# Altium schematic sheet 03_MCU.SchDoc: ECE315 MCU
size A; Date: 4/25/2017; ApprovedBy: JSK; CheckedBy: JSK; Author: JSK; CompanyName: University of Wisconsin; DrawnBy: JSK; Engineer: JSK; Organization: ECE 315; Address1: College of Engineering; Address2: 1415 Engineering Drive; Address3: Madison, WI 53706; Address4: ECE 315 Spring 2018; Revision: A; SheetNumber: 3; SheetTotal: 6; AssemblyNumber: ECE315-S18; ApprovedDate: 01/08/2018
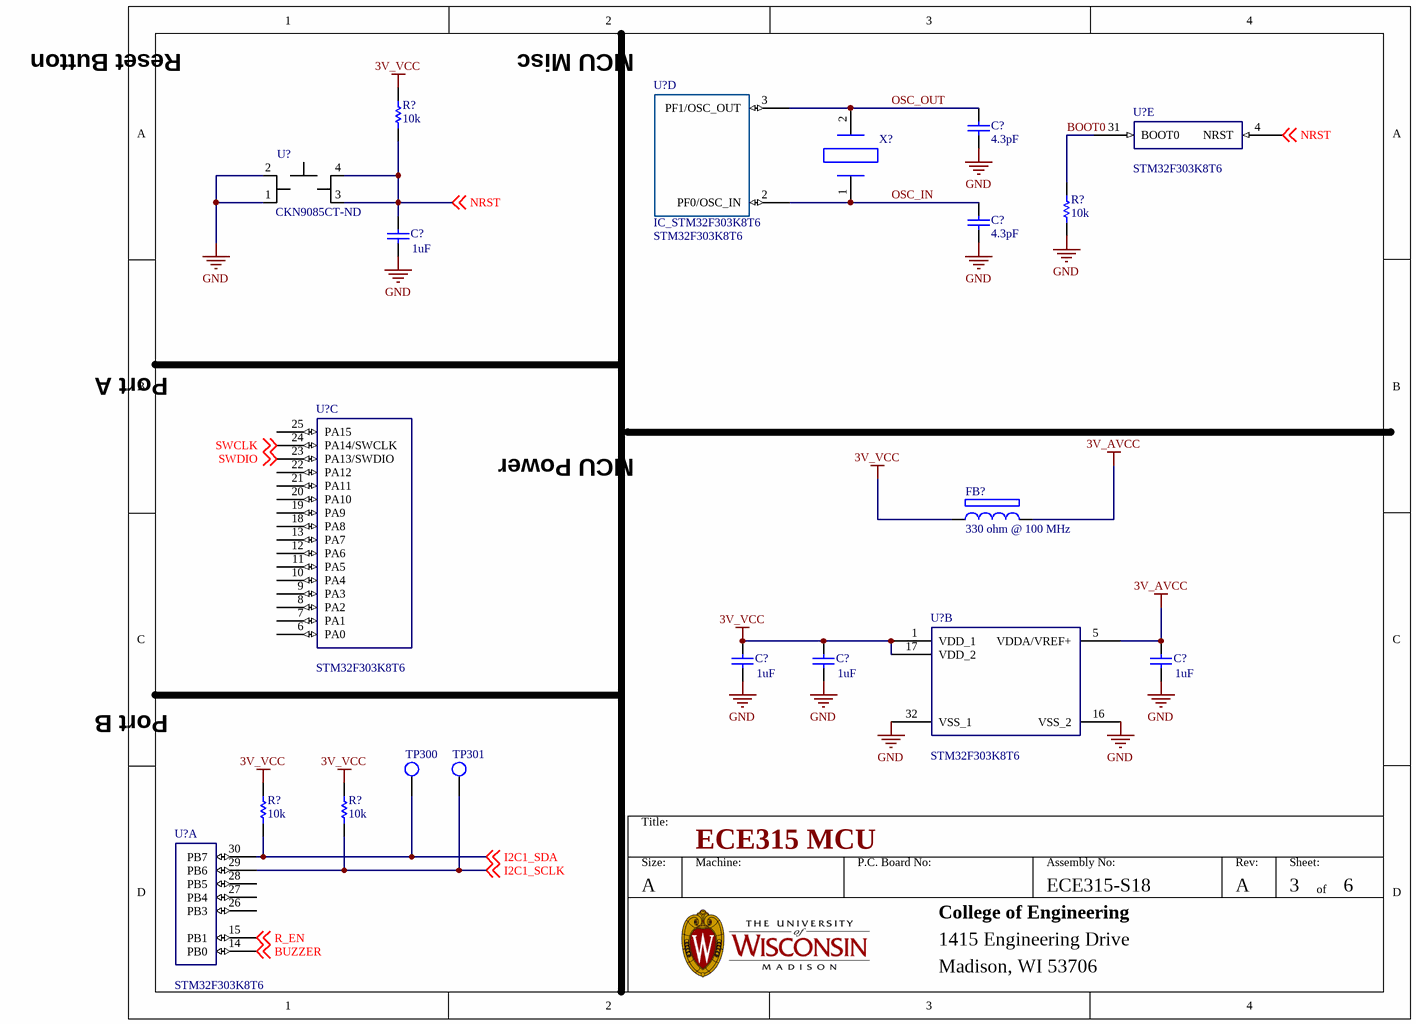
[diagram p0: 03_MCU.SchDoc]

## Parts
(Parts that share a designator on the sheet are numbered #1, #2 ... from top to bottom, then left to right.)
C?#1  Manufacturer Part Number: 4.3pF  [CAP_0805]  (hidden comment: CAP_0805_P_004.30)
C?#2  Capacity: 1uF  [CAP_0805]  (hidden comment: CAP_0805_U_001.00)
C?#3  Manufacturer Part Number: 4.3pF  [CAP_0805]  (hidden comment: CAP_0805_P_004.30)
C?#4  Capacity: 1uF  [CAP_0805]  (hidden comment: CAP_0805_U_001.00)
C?#5  Capacity: 1uF  [CAP_0805]  (hidden comment: CAP_0805_U_001.00)
C?#6  Capacity: 1uF  [CAP_0805]  (hidden comment: CAP_0805_U_001.00)
FB?  330 ohm @ 100 MHz  [FB_0805]
R?#1  10K  [RES_0805]
R?#2  10K  [RES_0805]
R?#3  10K  [RES_0805]
R?#4  10K  [RES_0805]
TP300  TP_1206  [TP-SMC-1206]  (value not drawn)
TP301  TP_1206  [TP-SMC-1206]  (value not drawn)
U?#1  IC_STM32F303K8T6  Manufacturer Part Number: STM32F303K8T6  [IC_STM32M]  (part D of 5)
U?#2  Manufacturer Part Number: STM32F303K8T6  [IC_STM32M]  (hidden comment: IC_STM32F303K8T6)  (part E of 5)
U?#3  Supplier Part Number 1: CKN9085CT-ND  [SW_6mm_6mm_SMT]  (hidden comment: SW_6mm_6mm_SMT)
U?#4  Manufacturer Part Number: STM32F303K8T6  [IC_STM32M]  (hidden comment: IC_STM32F303K8T6)  (part B of 5)
U?#5  Manufacturer Part Number: STM32F303K8T6  [IC_STM32M]  (hidden comment: IC_STM32F303K8T6)  (part C of 5)
U?#6  Manufacturer Part Number: STM32F303K8T6  [IC_STM32M]  (hidden comment: IC_STM32F303K8T6)  (part A of 5)
X?  32.7680KHZ 12.5PF  [NX3215SA-32.768K-STD-MUA-8]  (value not drawn)

## Nets
3V_AVCC: C?#6.1 FB?.2 U?#4.5(VDDA/VREF+)
3V_VCC: C?#4.1 C?#5.1 FB?.1 R?#1.2 R?#3.2 R?#4.2 U?#4.1(VDD_1) U?#4.17(VDD_2)
GND: C?#1.1 C?#2.2 C?#3.1 C?#4.2 C?#5.2 C?#6.2 R?#2.1 U?#3.1 U?#3.2 U?#4.16(VSS_2) U?#4.32(VSS_1)
BOOT0: R?#2.2 U?#2.31(BOOT0)
BUZZER: U?#6.14(PB0) ; off-sheet BUZZER
I2C1_SCLK: R?#4.1 TP301.1 U?#6.29(PB6) ; off-sheet I2C1_SCLK
I2C1_SDA: R?#3.1 TP300.1 U?#6.30(PB7) ; off-sheet I2C1_SDA
NRST: C?#2.1 R?#1.1 U?#2.4(NRST) U?#3.3 U?#3.4(VCCIO) ; off-sheet NRST
OSC_IN: C?#3.2 U?#1.2(PF0/OSC_IN) X?.1
OSC_OUT: C?#1.2 U?#1.3(PF1/OSC_OUT) X?.2
R_EN: U?#6.15(PB1) ; off-sheet R_EN
SWCLK: U?#5.24(PA14/SWCLK) ; off-sheet SWCLK
SWDIO: U?#5.23(PA13/SWDIO) ; off-sheet SWDIO

Not connected (* = marked no-connect by the designer): U?#5 6(PA0) 7(PA1) 8(PA2) 9(PA3) 10(PA4) 11(PA5) 12(PA6) 13(PA7) 18(PA8) 19(PA9) 20(PA10) 21(PA11) 22(PA12) 25(PA15); U?#6 26(PB3) 27(PB4) 28(PB5)

## Notes on the sheet
- Reset Button
- (near U?#1) MCU Misc
- Port A
- MCU Power
- Port B
- Title:
- Size:
- A
- Machine:
- P.C. Board No:
- Assembly No:
- Rev:
- Sheet:
- of
- College of Engineering
- 1415 Engineering Drive
- Madison, WI 53706

## Library data of the parts
C?#1 C?#3 = CAP_0805_P_004.30: CAP CER 4.3PF 100V NP0 0805; Manufacturer: AVX Corporation; Tolerance: ±0.25pF; Temperature Coefficient: C0G, NP0; Notification: Current market demand for these product types have resulted in fluctuating and extending lead times. Lead times may differ.; Supplier 1: Digi-Key; RoHS: RoHS Compliant; Category: Capacitors; Stock 1: 21910; Pricing 1: 1=0.24, 10=0.167, 100=0.0946, 500=0.0668, 1000=0.05844 (USD); Packaging: Cut Tape (CT); Part Status: Active; Voltage - Rated: 100V; Operating Temperature: -55°C ~ 125°C; Features: -; Ratings: -; Applications: General Purpose; Failure Rate: -; Mounting Type: Surface Mount, MLCC; Package / Case: 0805 (2012 Metric); Size / Dimension: 0.079" L x 0.049" W (2.01mm x 1.25mm); Height - Seated (Max): -; Thickness (Max): 0.037" (0.94mm); Lead Spacing: -; Lead Style: -; ComponentLink1URL: http://datasheets.avx.com/C0GNP0-Dielectric.pdf; ComponentLink1Description: http://datasheets.avx.com/C0GNP0-Dielectric.pdf; Supplier Part Number 1: 478-10404-1-ND
C?#2 C?#4-C?#6 = CAP_0805_U_001.00: CAP CER 1UF 16V 10% X7R 0805; Manufacturer: Yageo; Manufacturer Part Number: CC0805KKX7R7BB105; Notification: Current market demand for these product types have resulted in fluctuating and extending lead times. Lead times may differ.; Supplier 1: Digi-Key; RoHS: RoHS Compliant; Category: Capacitors; Stock 1: 1057802; Pricing 1: 1=0.11, 10=0.079, 100=0.0352, 500=0.02516, 1000=0.01977 (USD); Packaging: Cut Tape (CT); Part Status: Active; Tolerance: ±10%; Voltage - Rated: 16V; Temperature Coefficient: X7R; Operating Temperature: -55°C ~ 125°C; Features: -; Ratings: -; Applications: General Purpose; Failure Rate: -; Mounting Type: Surface Mount, MLCC; Package / Case: 0805 (2012 Metric); Size / Dimension: 0.079" L x 0.049" W (2.00mm x 1.25mm); Height - Seated (Max): -; Thickness (Max): 0.049" (1.25mm); Lead Spacing: -; Lead Style: -; ComponentLink1URL: http://www.yageo.com/documents/recent/UPY-GPHC_X7R_6.3V-to-50V_18.pdf; ComponentLink1Description: http://www.yageo.com/documents/recent/UPY-GPHC_X7R_6.3V-to-50V_18.pdf; Supplier Part Number 1: 311-1365-1-ND
FB? = FB 330 ohm @ 100 MHz: Manufacturer: TDK Corporation; Manufacturer Part Number: MPZ2012S331AT000; Current Rating: 2.5A; DC Resistance (DCR): 50 mOhm Max; Filter Type: Differential Mode - Single; Supplier 1: Digi-Key; RoHS: RoHS Compliant; Category: Filters; Stock 1: 154063; Pricing 1: 1=0.12, 10=0.101, 100=0.0574, 250=0.04528, 500=0.03824, 1000=0.03221 (USD); Packaging: Cut Tape (CT); Impedance @ Frequency: 330 Ohm @ 100MHz; Package / Case: 0805 (2012 Metric); Mounting Type: Surface Mount; Height (Max): 0.041" (1.05mm); Size / Dimension: 0.079" L x 0.049" W (2.00mm x 1.25mm); ComponentLink1URL: http://product.tdk.com/en/catalog/datasheets/beads_commercial_power_mpz_en.pdf; ComponentLink1Description: http://product.tdk.com/en/catalog/datasheets/beads_commercial_power_mpz_en.pdf; Supplier Part Number 1: 445-1569-1-ND
R?#1-R?#4 = RES_0805_K_010.00: RES SMD 10K OHM 1% 1/8W 0805; Manufacturer: Yageo; Manufacturer Part Number: RT0805FRE0710KL; Power (Watts): 0.125W, 1/8W; Temperature Coefficient: ±50ppm/°C; Supplier 1: Digi-Key; RoHS: RoHS Compliant; Category: Resistors; Stock 1: 74175; Pricing 1: 1=0.1, 10=0.075, 100=0.0287, 1000=0.01261, 2500=0.01089 (USD); Packaging: Cut Tape (CT); Part Status: Active; Tolerance: ±1%; Composition: Thin Film; Features: Moisture Resistant; Operating Temperature: -55°C ~ 155°C; Package / Case: 0805 (2012 Metric); Supplier Device Package: 0805; Size / Dimension: 0.079" L x 0.049" W (2.00mm x 1.25mm); Height - Seated (Max): 0.024" (0.60mm); Failure Rate: -; ComponentLink1URL: http://www.yageo.com/documents/recent/PYu-RT_1-to-0.01_RoHS_L_9.pdf; ComponentLink1Description: http://www.yageo.com/documents/recent/PYu-RT_1-to-0.01_RoHS_L_9.pdf; Supplier Part Number 1: YAG1239CT-ND; Resistance: 10k
TP300 TP301 = TP_1206: Test Point SMD 1206; Manufacturer: TE Connectivity (Tyco Electronics); Manufacturer Part Number: 1625854-1; Resistance Value: 0 Ohm; Temperature Coefficient: N/R; Supplier 1: Digi-Key; Stock 1: 31937; Pricing 1: 1=0.28, 10=0.261, 25=0.224, 50=0.1902, 100=0.1828, 250=0.1641, 500=0.1567, 1000=0.1306 (USD); Case Size: 1206; Dimension: 3.2 x 1.6 x 1.25mm; Family: RC; Mounting: Surface Mount; Operating Temperature: -55 to 125 C; Part No: 1625854-1; RoHS: Yes; Packaging: Tape and Reel; Termination Style: N/R; Terminal Pitch: N/R; Power Rating: N/R; Tolerance: N/R; ComponentLink1URL: https://datasheet.ciiva.com/6439/eng-ds-1773266-a-6439169.pdf; ComponentLink1Description: https://datasheet.ciiva.com/6439/eng-ds-1773266-a-6439169.pdf; ComponentLink2URL: https://datasheet.ciiva.com/30136/1773266-a-30136341.pdf; ComponentLink2Description: https://datasheet.ciiva.com/30136/1773266-a-30136341.pdf; ComponentLink3URL: https://datasheet.ciiva.com/6439/eng-ds-1773266-a-6439080.pdf; ComponentLink3Description: https://datasheet.ciiva.com/6439/eng-ds-1773266-a-6439080.pdf; ComponentLink4URL: https://datasheet.ciiva.com/6439/eng-ds-1773266-a-6439081.pdf; ComponentLink4Description: https://datasheet.ciiva.com/6439/eng-ds-1773266-a-6439081.pdf; ComponentLink5URL: https://datasheet.ciiva.com/6439/eng-ds-1773266-a-6439083.pdf; ComponentLink5Description: https://datasheet.ciiva.com/6439/eng-ds-1773266-a-6439083.pdf; Supplier Part Number 1: A106143CT-ND
U?#1 U?#2 U?#4-U?#6 = IC_STM32F303K8T6: Manufacturer: STMicroelectronics; Core Processor: ARM® Cortex®-M4; Core Size: 32-Bit; Speed: 72MHz; Connectivity: CAN, I²C, IrDA, LIN, SPI, UART/USART; Peripherals: DMA, I²S, POR, PWM, WDT; Program Memory Size: 64KB (64K x 8); Program Memory Type: FLASH; RAM Size: 12K x 8; Voltage - Supply (Vcc/Vdd): 2 V ~ 3.6 V; Data Converters: A/D 9x12b, D/A 3x12b; Oscillator Type: Internal; Supplier 1: Digi-Key; RoHS: RoHS Compliant; Category: Integrated Circuits (ICs); Stock 1: 1323; Pricing 1: 1=4.28, 10=3.846, 100=3.1512, 500=2.68256, 1000=2.2624 (USD); Packaging: Tray; Part Status: Active; EEPROM Size: -; Operating Temperature: -40°C ~ 85°C (TA); Package / Case: 32-LQFP; Supplier Device Package: 32-LQFP (7x7); ComponentLink1URL: http://www.st.com/content/ccc/resource/technical/document/datasheet/group3/38/c6/ca/d1/f7/d5/4e/30/DM00092070/files/DM00092070.pdf/jcr:content/translations/en.DM00092070.pdf; ComponentLink1Description: http://www.st.com/content/ccc/resource/technical/document/datasheet/group3/38/c6/ca/d1/f7/d5/4e/30/DM00092070/files/DM00092070.pdf/jcr:content/translations/en.DM00092070.pdf; Supplier Part Number 1: 497-15828-ND
U?#3 = SW_6mm_6mm_SMT: SWITCH TACTILE SPST-NO 0.05A 12V; Manufacturer: C&K; Manufacturer Part Number: PTS645SH50SMTR92 LFS; Switch Function: Off-Mom; Contact Rating @ Voltage: 0.05A @ 12VDC; Actuator Type: Standard; Actuator Height off PCB, Vertical: 5.00mm; Actuator Orientation: Top Actuated; Outline: 6.00mm x 6.00mm; Illumination: Non-Illuminated; Operating Force: 200gf; Actuator Material: Polyamide (PA66), Nylon 6/6; Mechanical Life: 100,000 Cycles; Supplier 1: Digi-Key; RoHS: RoHS Compliant; Category: Switches; Stock 1: 73248; Pricing 1: 1=0.22, 10=0.215, 25=0.2076, 50=0.2002, 100=0.1891, 250=0.17796, 500=0.17054 (USD); Packaging: Cut Tape (CT); Part Status: Active; Circuit: SPST-NO; Mounting Type: Surface Mount; Actuator Length, Right Angle: -; Termination Style: Gull Wing; Illumination Type, Color: -; Illumination Voltage (Nominal): -; Ingress Protection: -; Features: -; Switch Travel: -; Operating Temperature: -20°C ~ 60°C; ComponentLink1URL: http://www.ckswitches.com/media/1471/pts645.pdf; ComponentLink1Description: http://www.ckswitches.com/media/1471/pts645.pdf
X? = CRYSTAL_NX3215SA-32.768K: CRYSTAL 32.768KHZ 12.5PF SMD; Manufacturer: Nihon Dempa Kogyo (NDK); Catalog Drawings: NX3215SA Series Top / NX3215SA Series Side / NX3215SA Series Bottom / NX3215SA Series Circuit; Featured Product: NX3215SA Series 32.768KHz SMD Crystals; Frequency Tolerance: ±20ppm; ESR (Equivalent Series Resistance): 70 kOhm; Operating Mode: Fundamental; Dynamic Catalog: NX3215SA Series; Other Names: 644-1156-6; Supplier 1: Digikey; Stock 1: 45314; Pricing 1: 1=0.94, 10=0.835, 50=0.7804, 100=0.6897, 500=0.6534, 1000=0.5445 (USD); Standard Package: 1; Category: Crystals and Oscillators; Family: Crystals; Series: NX3215SA; Type: kHz Crystal (Tuning Fork); Frequency: 32.768kHz; Load Capacitance: 12.5pF; Operating Temperature: -40°C ~ 85°C; Mounting Type: Surface Mount; Package / Case: 2-SMD; Size / Dimension: 0.126" L x 0.059" W (3.20mm x 1.50mm); Height: 0.035" (0.90mm); Packaging: Digi-Reel®; ComponentLink1URL: https://datasheet.ciiva.com/857/c-nx3215sa-std-mua-9-e-857050.pdf; ComponentLink1Description: https://datasheet.ciiva.com/857/c-nx3215sa-std-mua-9-e-857050.pdf; ComponentLink2URL: https://datasheet.ciiva.com/857/c-nx3215sa-std-mua-9-e-857051.pdf; ComponentLink2Description: https://datasheet.ciiva.com/857/c-nx3215sa-std-mua-9-e-857051.pdf; ComponentLink3URL: https://datasheet.ciiva.com/857/c-nx3215sa-std-mua-9-e-857052.pdf; ComponentLink3Description: https://datasheet.ciiva.com/857/c-nx3215sa-std-mua-9-e-857052.pdf; Supplier Part Number 1: 644-1156-1-ND; Manufacturer Part Number: NX3215SA-32.768K-STD-MUA-8